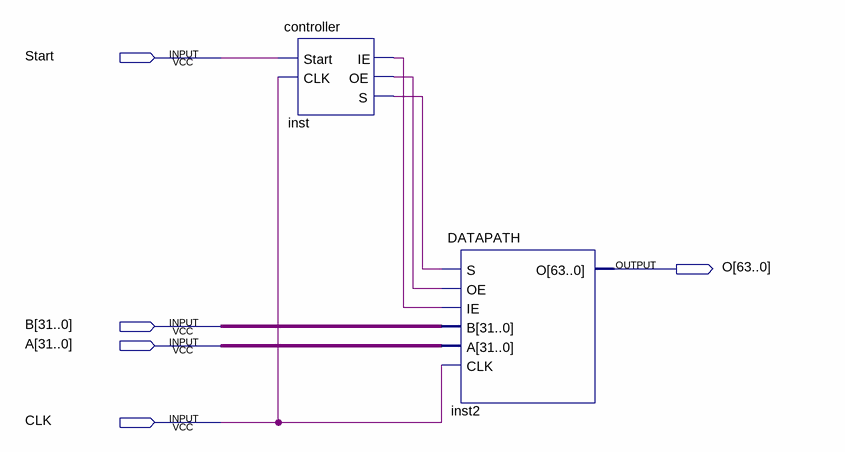
[diagram p0: schematic sheet]
// Quartus schematic multi.bdf as structural Verilog: 2 symbols, 5 pins
module multi (
  input  Start,
  input  [31:0] B,
  input  [31:0] A,
  input  CLK,
  output [63:0] O
);

  wire inst_ie, inst_oe, inst_s;

  controller inst (.Start(Start), .CLK(CLK), .IE(inst_ie), .OE(inst_oe), .S(inst_s));
  DATAPATH inst2 (.S(inst_s), .OE(inst_oe), .IE(inst_ie), .B(B), .A(A), .CLK(CLK), .O(O));
endmodule
